# Altium schematic sheet EGT003.SchDoc
size A4; SheetNumber: 3; SheetTotal: 4
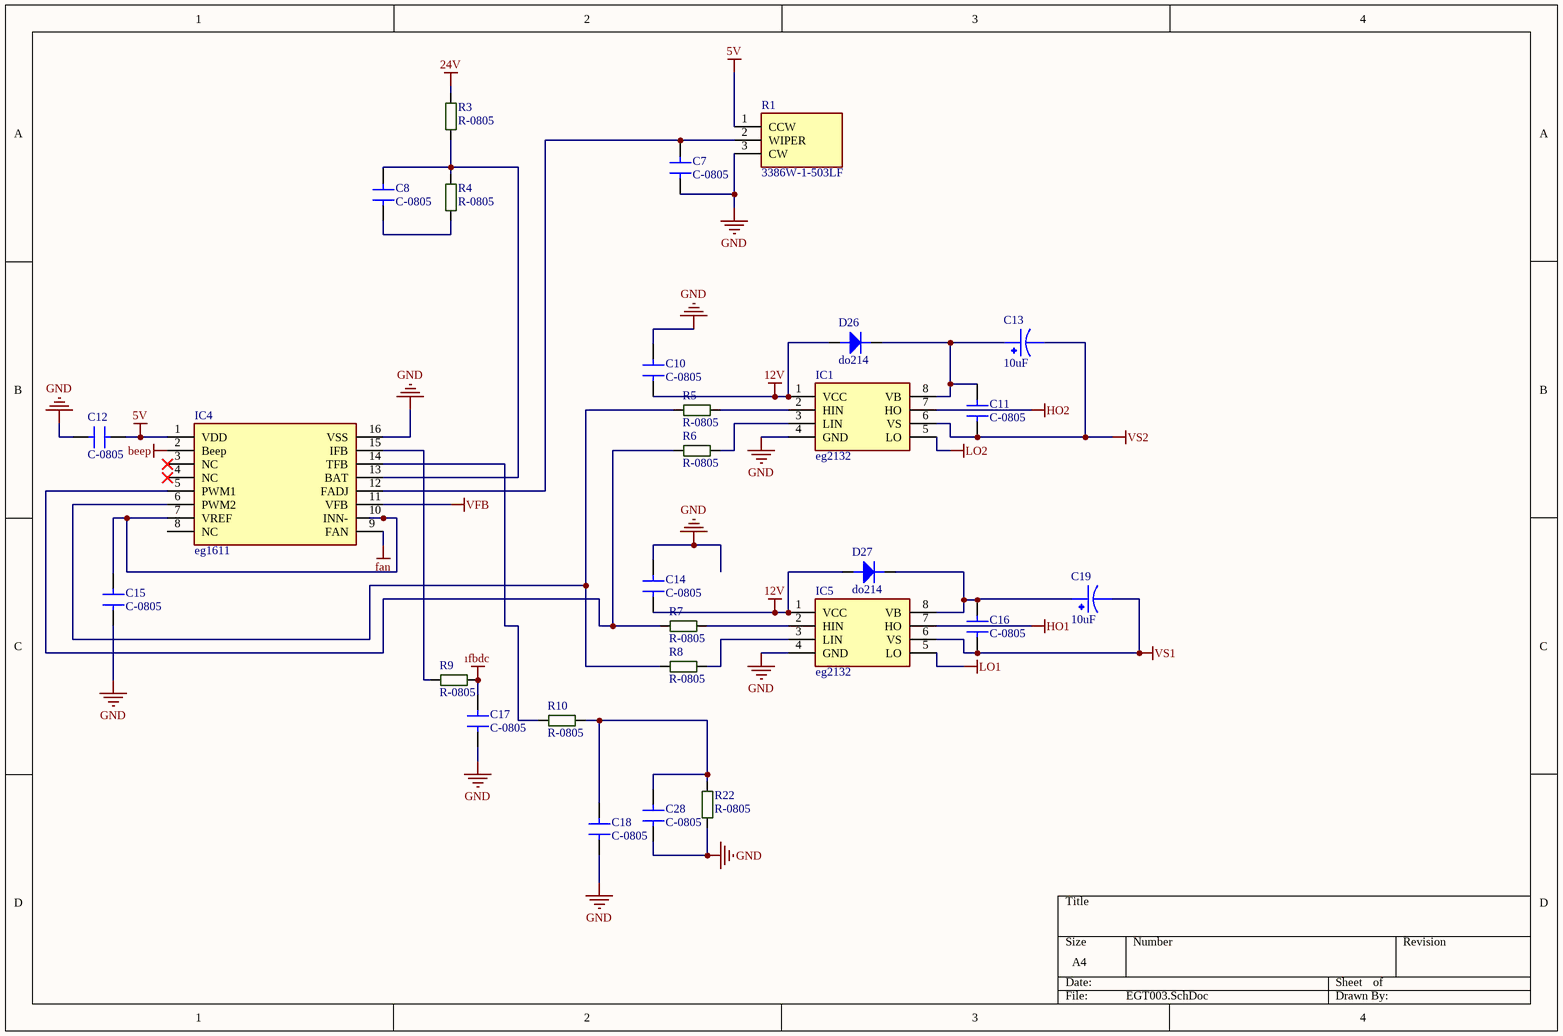
[diagram p0: EGT003.SchDoc]

## Parts
C7  C-0805  [C-0805W]
C8  C-0805  [C-0805W]
C10  C-0805  [C-0805W]
C11  C-0805  [C-0805W]
C12  C-0805  [C-0805W]
C13  10uF  [CapSmdElc]
C14  C-0805  [C-0805W]
C15  C-0805  [C-0805W]
C16  C-0805  [C-0805W]
C17  C-0805  [C-0805W]
C18  C-0805  [C-0805W]
C19  10uF  [CapSmdElc]
C28  C-0805  [C-0805W]
D26  do214  [DO-214AC]
D27  do214  [DO-214AC]
IC1  eg2132  [SOIC127P600X175-8N]
IC4  eg1611  [SOIC127P600X175-16N]
IC5  eg2132  [SOIC127P600X175-8N]
R1  3386W-1-503LF  [3386W]
R3  R-0805  [R-0805W]
R4  R-0805  [R-0805W]
R5  R-0805  [R-0805W]
R6  R-0805  [R-0805W]
R7  R-0805  [R-0805W]
R8  R-0805  [R-0805W]
R9  R-0805  [R-0805W]
R10  R-0805  [R-0805W]
R22  R-0805  [R-0805W]

## Nets
5V: C12.2 IC4.1(VDD) R1.1(CCW)
12V: C10.1 C14.1 D26.a D27.a IC1.1(VCC) IC5.1(VCC)
24V: R3.2
beep: IC4.2(Beep)
fan: IC4.9(FAN)
GND: C7.1 C10.2 C12.1 C14.2 C15.1 C17.1 C18.1 C28.1 IC1.4(GND) IC4.16(VSS) IC5.4(GND) R1.3(CW) R22.1
HO1: IC5.7(HO)
HO2: IC1.7(HO)
LO1: IC5.5(LO)
LO2: IC1.5(LO)
VFB: IC4.11(VFB)
VS1: C16.1 C19.2 IC5.6(VS)
VS2: C11.1 C13.2 IC1.6(VS)
ıfbdc: C17.2 R9.1
NetC7_2: C7.2 IC4.12(FADJ) R1.2(WIPER)
NetC8_1: C8.1 R4.1
NetC8_2: C8.2 IC4.13(BAT) R3.1 R4.2
NetC11_2: C11.2 C13.1 D26.k IC1.8(VB)
NetC15_2: C15.2 IC4.7(VREF) IC4.10(INN-)
NetC16_2: C16.2 C19.1 D27.k IC5.8(VB)
NetC18_2: C18.2 C28.2 R10.1 R22.2
NetIC1_2: IC1.2(HIN) R5.1
NetIC1_3: IC1.3(LIN) R6.1
NetIC4_5: IC4.5(PWM1) R6.2 R7.2
NetIC4_6: IC4.6(PWM2) R5.2 R8.2
NetIC4_14: IC4.14(TFB) R10.2
NetIC4_15: IC4.15(IFB) R9.2
NetIC5_2: IC5.2(HIN) R7.1
NetIC5_3: IC5.3(LIN) R8.1

Not connected (* = marked no-connect by the designer): IC4 3(NC)* 4(NC)* 8(NC)

## Library data of the parts
C13 C19 = 100 uF Electr Cap
D26 D27 = do214: DIODE FAST SWITCHING Single 150mA 75V SMT SOD323
IC1 IC5 = eg2132: Integrated Circuit; Manufacturer_Name: Texas Instruments; Manufacturer_Part_Number: LM393ADR; Datasheet Link: http://www.ti.com/lit/ds/symlink/lm393a.pdf; Height: 1.75mm; Mouser Part Number: 595-LM393ADR; Mouser Price/Stock: https://www.mouser.co.uk/ProductDetail/Texas-Instruments/LM393ADR?qs=VolsR0DjNPq76ZV6Dhd8nQ%3D%3D; Arrow Part Number: LM393ADR; Arrow Price/Stock: https://www.arrow.com/en/products/lm393adr/texas-instruments
IC4 = eg1611: Integrated Circuit; Manufacturer_Name: STMicroelectronics; Manufacturer_Part_Number: HCF4538M013TR; Datasheet Link: http://www.st.com/resource/en/datasheet/cd00000410.pdf; Height: 1.75mm; Mouser Part Number: 511-4538BM-TR; Mouser Price/Stock: https://www.mouser.com/Search/Refine.aspx?Keyword=511-4538BM-TR
R1 = 3386W-1-503LF: Resistor; Manufacturer_Name: Bourns; Datasheet Link: http://www.bourns.com/docs/Product-Datasheets/3386.pdf; Manufacturer_Part_Number: 3386W-1-503LF; Mouser Part Number: 652-3386W-1-503LF; Mouser Price/Stock: https://www.mouser.co.uk/ProductDetail/Bourns/3386W-1-503LF?qs=aZhnFHiXcUS20GqScAFfrw%3D%3D; Arrow Part Number: 3386W-1-503LF; Arrow Price/Stock: https://www.arrow.com/en/products/3386w-1-503lf/bourns